# EAGLE design gadgeteer_HD44780 (EAGLE 6.3)
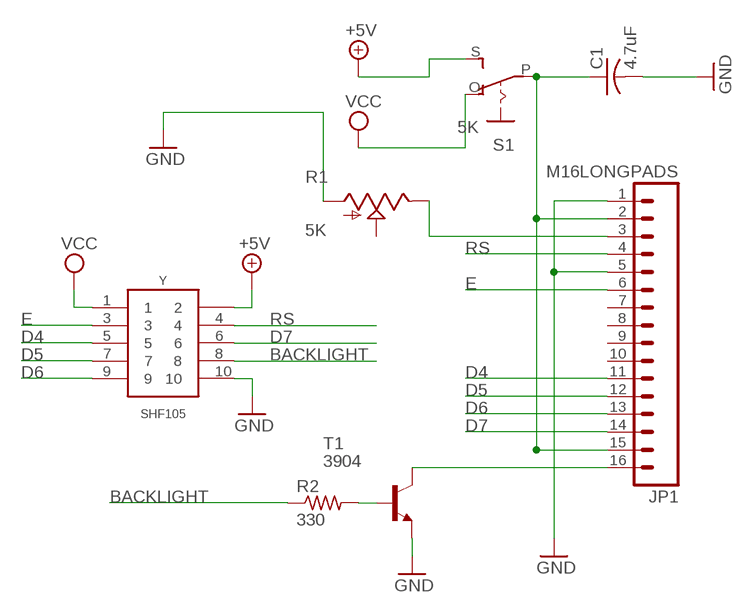
[diagram p0: schematic, sheet 1]

## Parts
C1  4.7uF  C-USC1206K  [C1206K]
JP1  M16LONGPADS  [1X16_LONGPADS]
R1  5K  POTENTIOMETER  [BOURNS-TC33X]
R2  330  R-US_R0603  [R0603]
S1  5K  EG1218S  [EG1218]
T1  3904  MMBT3904LT1-NPN-SOT23-BEC  [SOT23-BEC]
Y  SHF105  [GAD_PAC_SMD]

## Nets
+5V: S1.S Y.2
BACKLIGHT: R2.1 Y.8
D4: JP1.11 Y.5
D5: JP1.12 Y.7
D6: JP1.13 Y.9
D7: JP1.14 Y.6
E: JP1.6 Y.3
GND: C1.2 JP1.1 JP1.5 R1.1(A) T1.E Y.10
N$1: JP1.3 R1.3(E)
N$2: C1.1 JP1.2 JP1.15 S1.P
N$3: R2.2 T1.B
N$4: JP1.16 T1.C
RS: JP1.4 Y.4
VCC: S1.O Y.1
Unconnected: JP1.7 JP1.8 JP1.9 JP1.10 R1.2(S)

## Library data of the parts
C1 = adafruit:C-US: CAPACITOR, American symbol
JP1 = SparkFun-Connectors:M16: 1x16 .1" header
R1 = ozlollc:POTENTIOMETER: TC33X - BOURNS.INC DIGIKEY# TC33X-502ETR-ND (5K OHMS)
R2 = adafruit:R-US_: RESISTOR, American symbol
S1 = adafruit:EG1218: SLIDING SWITCH 0.1" spacing through hole, vertical SPDT slide switch http://www.ladyada.net/library/pcb/eaglelibrary.html
T1 = transistor:*-NPN-: NPN Transistror BF959 corrected 2008.03.06
Y = ozlollc:SHF105

## Board
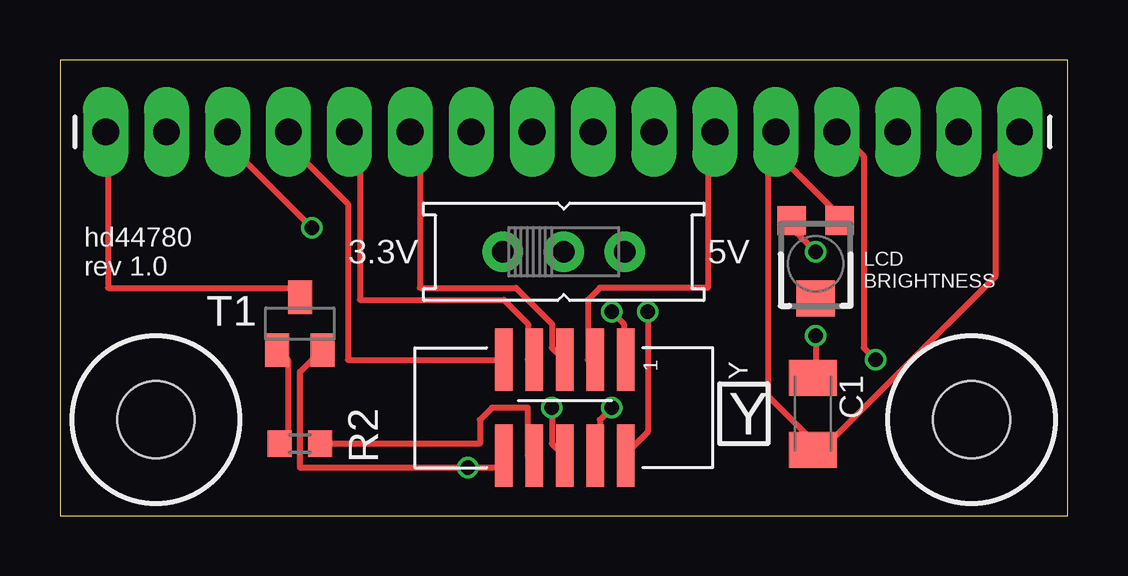
[diagram p1: board, top side]
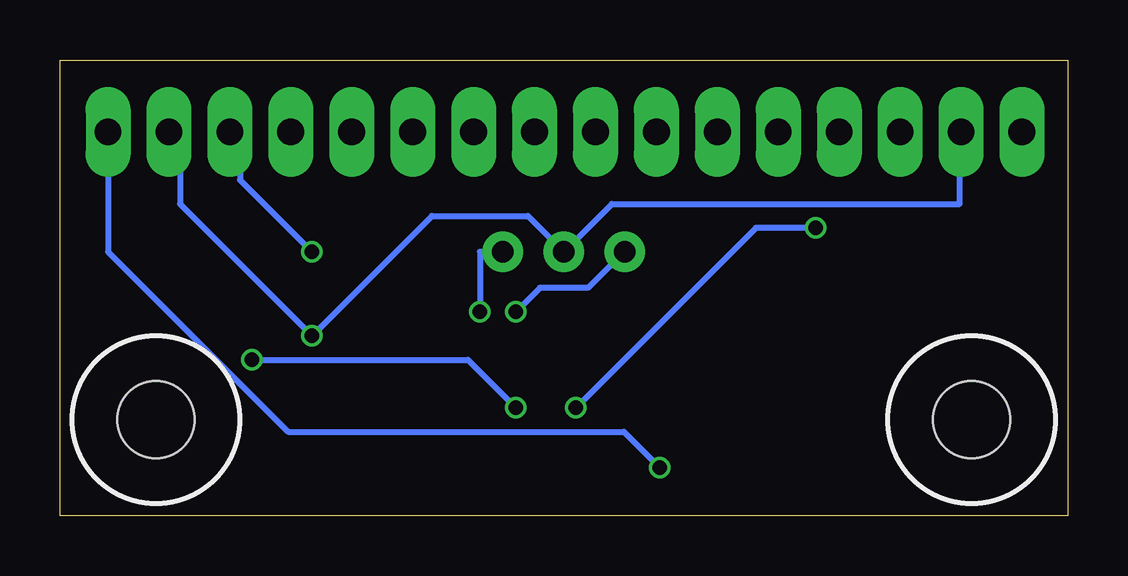
[diagram p2: board, bottom side, seen from below]

Size 42 x 19 mm. Coordinates in mm from the lower left corner, seen from the top.
Outline: 0,0 42,0 42,19 0,19 0,0
Copper layers (1*16): Top 0.035mm / dielectric 1.5mm / Bottom 0.035mm
Design rules "Fusion_eagle_rule_v1.1": minimum track width 6mil, minimum drill 12mil, track to track 6mil, track to pad 6mil, pad to pad 6mil, via to via 6mil, smd to smd 0mil, copper to edge 10mil, drill to drill 10mil, minimum pad ring 10mil, minimum via ring 6mil, stop-mask expansion 2mil, vias tented up to drill 100mil, thermal gap 10mil

### Footprints (pad centres in the part's own frame; a part is rotated, then mirrored left to right if it is on the bottom)
C1206K = smd 1.5 x 2: 1 -1.5,0; 2 1.5,0
1X16_LONGPADS = drill 1.118 pad 1.88 long: 1 0,0; 2 2.54,0; 3 5.08,0; 4 7.62,0; 5 10.16,0; 6 12.7,0; 7 15.24,0; 8 17.78,0; 9 20.32,0; 10 22.86,0; 11 25.4,0; 12 27.94,0; 13 30.48,0; 14 33.02,0; 15 35.56,0; 16 38.1,0
BOURNS-TC33X = smd 1.2 x 1.2: 1 -1,-1.8; 3 1,-1.8 | smd 1.6 x 1.5: 2 0,1.45
R0603 = smd 1 x 1.1: 1 -0.85,0; 2 0.85,0
EG1218 = drill 0.9 pad 1.676: O -2.54,0; P 0,0; S 2.54,0
SOT23-BEC = smd 1 x 1.4: B -0.95,-1.1; C 0,1.1; E 0.95,-1.1
HOLE3.2 = hole 3.2: 0,0
GAD_PAC_SMD = smd 2.6 x 0.74: 1 -2,2.58; 2 2,2.58; 3 -2,1.31; 4 2,1.31; 5 -2,0.04; 6 2,0.04; 7 -2,-1.23; 8 2,-1.23; 9 -2,-2.5; 10 2,-2.5

### Placement (x,y rotation side)
C1  31.38,4.25 270 top
JP1  40,16 180 top
R1  31.5,10.5 180 top
R2  10,3 180 top
S1  21,11 0 top
T1  10,8 0 top
U$2  [HOLE3.2]  4,4 0 top
U$3  [HOLE3.2]  38,4 0 top
Y  21,4.5 270 top

### Tracks (layer width: path | path; a pad name or v marks a point on that pad's centre or on a via)
+5V  (via drill 0.61)
  Top 0.254: v24.5,8.5 24.5,3.5 23.5,2.5 Y.2
  Bottom 0.254: v24.5,8.5 24.5,11 24,11 S1.S
BACKLIGHT
  Top 0.254: R2.1 11,3 17.5,3 17.5,4 18,4.5 19.5,4.5 19.5,2.5 Y.8
D4
  Top 0.254: Y.5 21,6.5 20.5,7 20.5,8 19,9.5 15,9.5 15,16 JP1.11
D5
  Top 0.254: Y.7 19.5,6.5 19.5,8 18.5,9 12.5,9 12.5,16 JP1.12
D6
  Top 0.254: Y.9 12,6.5 12,13 10,15 10,16 JP1.13
D7  (via drill 0.61)
  Top 0.254: v20.5,4.5 20.5,3 21,2.5 Y.6 | v10.5,12 7,15.5 7,16 JP1.14
  Bottom 0.254: v20.5,4.5 13,12 v10.5,12
E
  Top 0.254: Y.3 22,6.5 22,9 22.5,9.5 27,9.5 27,16 JP1.6
GND  (via drill 0.61)
  Top 0.152: 31.5,3 C1.2 31.5,2.5
  Top 0.254: Y.10 18.5,2 v17,2 10,2 10,6 10.5,6.5 T1.E | R1.1 32.5,12.5 30,15 30,16 JP1.5 29.5,16 29.5,5 31.5,3 | JP1.1 39,15 39,10 31.5,2.5
  Bottom 0.254: v17,2 18.5,3.5 32.5,3.5 40,11 JP1.1
N$1  (via drill 0.61)
  Top 0.254: v31.5,11 30.5,12 R1.3
  Bottom 0.254: v31.5,11 34.5,14 34.5,16 JP1.3
N$2  (via drill 0.61)
  Top 0.152: 31.5,6 C1.1
  Top 0.254: v31.5,7.5 31.5,6 31.5,5.5
  Bottom 0.254: JP1.2 37,16 37,13 v31.5,7.5 26.5,12.5 22.5,12.5 S1.P 19,13 4.5,13 4.5,16 JP1.15
N$3
  Top 0.254: R2.2 9.5,3 9.5,6.5 T1.B
N$4
  Top 0.254: T1.C 10,9.5 2,9.5 2,16 JP1.16
RS  (via drill 0.61)
  Top 0.254: v23,4.5 22.5,4 22.5,2.5 Y.4 | v34,6.5 33.5,7 33.5,15 32.5,16 JP1.4
  Bottom 0.254: v23,4.5 25,6.5 v34,6.5
VCC  (via drill 0.61)
  Top 0.254: v23,8.5 23.5,8 23.5,6.5 Y.1
  Bottom 0.254: v23,8.5 22,9.5 20,9.5 18.5,11 S1.O

### Text on the board
tNames: hd44780 / rev 1.0 | 3.3V | 5V | LCD / BRIGHTNESS | Y